# Altium schematic sheet DAC_SPI.SchDoc
size A; SheetNumber: 1; SheetTotal: 1
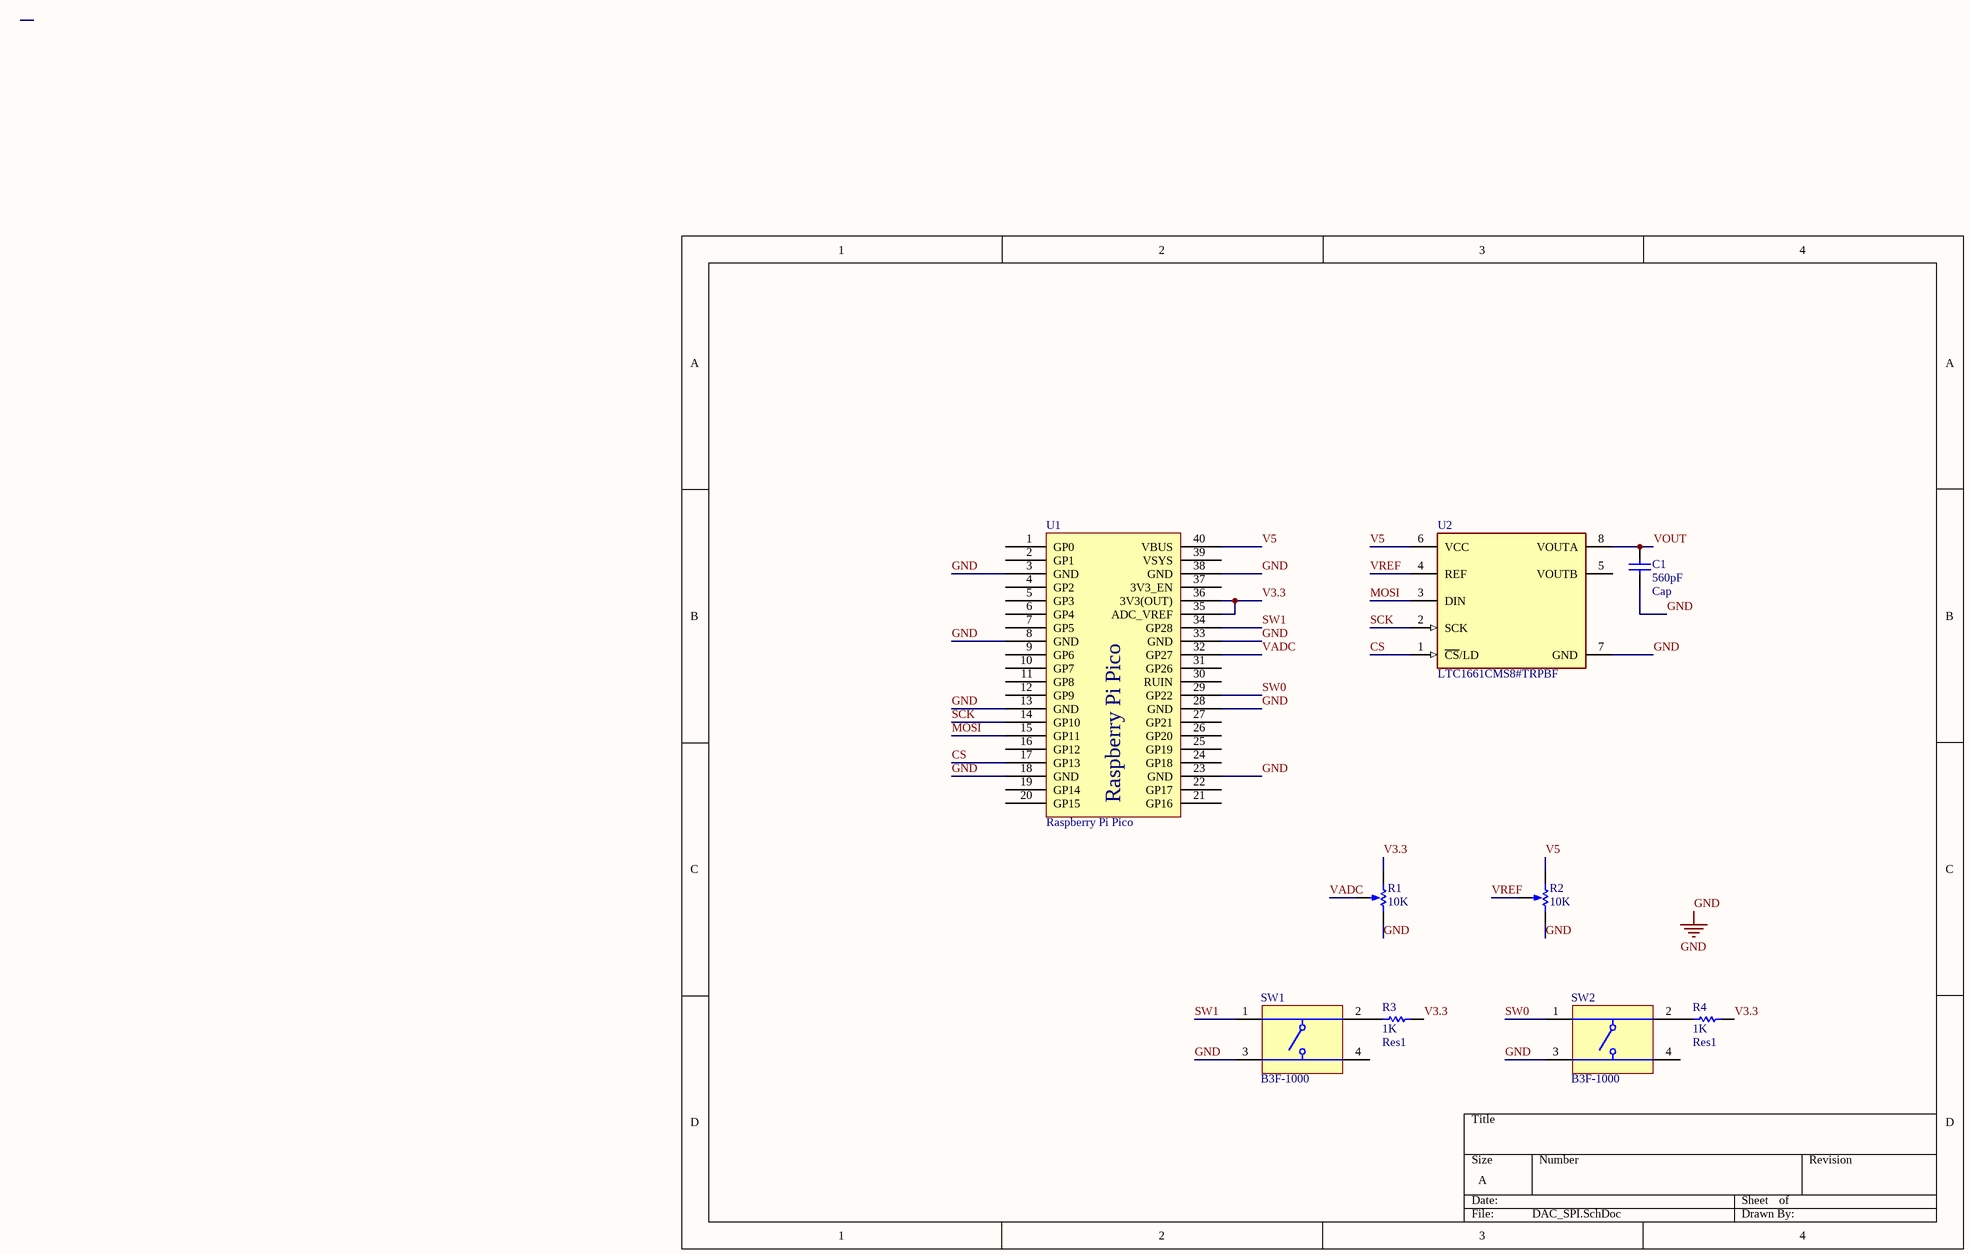
[diagram p0: DAC_SPI.SchDoc]

## Parts
C1  Cap  value 560pF  [RAD-0.3]
R1  value 10K  [POT inline wide]  (hidden comment: RPot_1)
R2  value 10K  [POT inline wide]  (hidden comment: RPot_1)
R3  Res1  value 1K  [AXIAL-0.3]
R4  Res1  value 1K  [AXIAL-0.3]
SW1  B3F-1000  [OMRON-B3F-1000-4_V]
SW2  B3F-1000  [OMRON-B3F-1000-4_V]
U1  Raspberry Pi Pico  [Raspberry Pi Pico]
U2  LTC1661CMS8#TRPBF  [FP-MS8-8-05-08-1660-IPC_A]

## Nets
GND: C1.1 R1.3(BOT) R2.3(BOT) SW1.3 SW2.3 U1.3(GND) U1.8(GND) U1.13(GND) U1.18(GND) U1.23(GND) U1.28(GND) U1.33(GND) U1.38(GND) U2.7(GND)
CS: U1.17(GP13) U2.1(~{CS}/LD)
MOSI: U1.15(GP11) U2.3(DIN)
SCK: U1.14(GP10) U2.2(SCK)
SW0: SW2.1 U1.29(GP22)
SW1: SW1.1 U1.34(GP28)
V3.3: R1.1(TOP) R3.2 R4.2 U1.35(ADC_VREF) U1.36(3V3(OUT))
V5: R2.1(TOP) U1.40(VBUS) U2.6(VCC)
VADC: R1.2(TAP) U1.32(GP27)
VOUT: C1.2 U2.8(VOUTA)
VREF: R2.2(TAP) U2.4(REF)
NetR3_1: R3.1 SW1.2
NetR4_1: R4.1 SW2.2

Not connected (* = marked no-connect by the designer): SW1 4; SW2 4; U1 1(GP0) 2(GP1) 4(GP2) 5(GP3) 6(GP4) 7(GP5) 9(GP6) 10(GP7) 11(GP8) 12(GP9) 16(GP12) 19(GP14) 20(GP15) 21(GP16) 22(GP17) 24(GP18) 25(GP19) 26(GP20) 27(GP21) 30(RUIN) 31(GP26) 37(3V3_EN) 39(VSYS); U2 5(VOUTB)

## Library data of the parts
C1 = Cap: Capacitor; Published: 8-Jun-2000; LatestRevisionDate: 17-Jul-2002; LatestRevisionNote: Re-released for DXP Platform.; PackageReference: RAD-0.3; Publisher: Altium Limited; PackageDescription: Radial Cap, Thru-Hole; 2 Leads; 0.3 in Pin Spacing
R1 R2 = RPot_3: Potentiometer; Sim Note: Enter the Resistance value and the set point into parameter fields.; Set Position: 0.5; Published: 8-Jun-2000; LatestRevisionDate: 17-Jul-2002; LatestRevisionNote: Re-released for DXP Platform.; PackageReference: VR5; Publisher: Altium Limited; PackageDescription: Variable Resistor, Thru-Hole; 3 Leads
R3 R4 = Res1: Resistor; Published: 8-Jun-2000; LatestRevisionDate: 17-Jul-2002; LatestRevisionNote: Re-released for DXP Platform.; PackageReference: AXIAL-0.3; Publisher: Altium Limited; PackageDescription: Axial Device, Thru-Hole; 2 Leads; 0.3 in Pin Spacing
SW1 SW2 = CMP-1677-00002-1: Tactile Switch, SPST-NO, 0.05 A, 5 to 24 V, -25 to 70 degC, 4-Pin THD, RoHS, Bulk; Shielding: Shielded; Gender: Female; Capacitance: -45 f; Voltage Rating: 150 V; Current Rating: 1.5 A; Radiation Hardening: No; Contact Plating: Gold; Height: 14.99 mm; Min Operating Temperature: -40 degC; Packaging: Tray; ComponentLink2Description: Datasheet; ComponentLink1URL: http://www.omron.com/; Lead Pitch: 1.27 mm; RoHSCompliant: true; Pins: 8; PackageReference: B3F-1000; Width: 25.4 mm; Contact Material: Brass; ComponentLink2URL: http://www.omron.com/ecb/products/pdf/en-b3f.pdf; PackageDescription: 4-Pin Through Hole Device, Body 6 x 6 mm; DatasheetVersion: Jan-15; ComponentLink1Description: Manufacturer URL; Package Quantity: 1080; Mount: Through Hole; Length: 18.34 mm; Max Operating Temperature: 70 degC
U2 = CMP-09082-000102-1: IC DAC 10BIT V-OUT 8MSOP; Output Type: Voltage; Min Supply Voltage: 2.7V; Interface: Serial; Integral Nonlinearity (INL): 2LSB; Resolution: 10b; Max Supply Voltage: 5.5V; Number of Bits: 10; Supply Type: Single; Settling Time: 30us; Number of Converters: 2; Min Operating Temperature: 0°C; Lead Free: Lead Free; Number of Pins: 8; Packaging: Tape and Reel; Mount: Surface Mount; Max Operating Temperature: 70°C; Package Quantity: 2500; Number of Channels: 2; Case/Package: MSOP